# EAGLE design wohnzimmer_im_router (EAGLE 5.11)
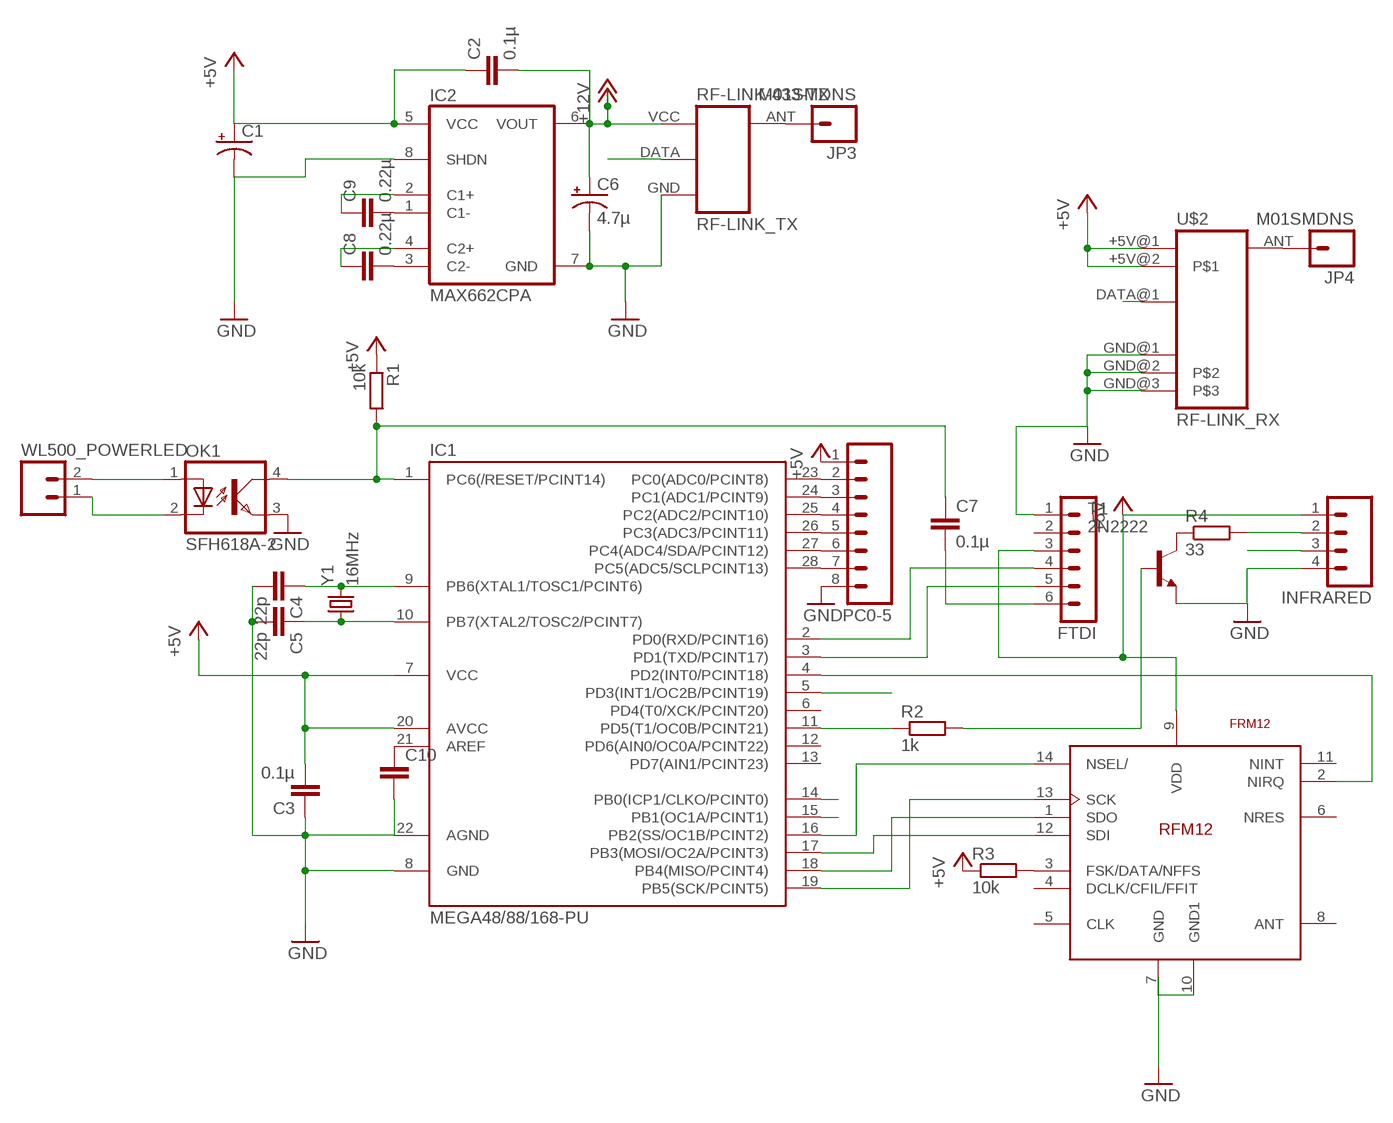
[diagram p0: schematic, sheet 1]

## Parts
C1  CAP_POLPTH2  [CPOL-RADIAL-10UF-25V]
C2  0.1µ  CAPKIT  [CAP-PTH-SMALL-KIT]
C3  0.1µ  CAPPTH  [CAP-PTH-SMALL]
C4  22p  CAPPTH  [CAP-PTH-SMALL]
C5  22p  CAPPTH  [CAP-PTH-SMALL]
C6  4.7µ  CAP_POLPTH2  [CPOL-RADIAL-10UF-25V]
C7  0.1µ  CAPKIT  [CAP-PTH-SMALL-KIT]
C8  0.22µ  CAPKIT  [CAP-PTH-SMALL-KIT]
C9  0.22µ  CAPKIT  [CAP-PTH-SMALL-KIT]
C10  CAPPTH  [CAP-PTH-SMALL]
FTDI  MA06-1  [MA06-1]
IC1  MEGA48/88/168-PU  [DIL28-3]
IC2  MAX662CPA  [DIL08]
INFRARED  M04PTH  [1X04]
JP3  M01SMDNS  [1X01NS]
JP4  M01SMDNS  [1X01NS]
OK1  SFH618A-2  [DIP4]
PC0-5  M08LOCK  [1X08_LOCK]
R1  10k  R-EU_0207/7  [0207/7]
R2  1k  R-EU_0204/7  [0204/7]
R3  10k  R-EU_0204/7  [0204/7]
R4  33  R-EU_0204/7  [0204/7]
RF-LINK-433-TX  RF-LINK_TX  [RF-LINK_TX]
T1  2N2222  [TO18]
U$1  FRM12  [RFM12]
U$2  RF-LINK_RX  [RF-LINK_RX]
WL500_POWERLED  M02LOCK  [1X02_LOCK]
Y1  16MHz  CRYSTALHC49US  [HC49US]

## Nets
+5V: C1.1(+) C2.1 C3.2 FTDI.3 IC1.7(VCC) IC1.20(AVCC) IC2.5(VCC) INFRARED.1 PC0-5.1 R1.1 R3.1 U$1.9(VDD) U$2.+5V@1(+5V) U$2.+5V@2
+12V: C2.2 C6.1(+) IC2.6(VOUT) RF-LINK-433-TX.VCC(+5V)
FOO: IC1.11(PD5(T1/OC0B/PCINT21)) R2.1
GND: C1.2(-) C3.1 C4.2 C5.2 C6.2(-) C10.2 FTDI.1 IC1.8(GND) IC1.22(AGND) IC2.7(GND) IC2.8(SHDN) INFRARED.4 OK1.3(EMIT) PC0-5.8 RF-LINK-433-TX.GND T1.1(E) U$1.7(GND) U$1.10(GND1) U$2.GND@1(GND) U$2.GND@2 U$2.GND@3
IR_DIODE-: INFRARED.2 R4.2
IR_RX: IC1.14(PB0(ICP1/CLKO/PCINT0)) INFRARED.3
MOSI: IC1.17(PB3(MOSI/OC2A/PCINT3)) U$1.12(SDI)
N$1: IC1.19(PB5(SCK/PCINT5)) U$1.13(SCK)
N$2: IC1.18(PB4(MISO/PCINT4)) U$1.1(SDO)
N$3: OK1.1(A) WL500_POWERLED.2
N$4: IC1.16(PB2(SS/OC1B/PCINT2)) U$1.14(NSEL/)
N$5: IC1.4(PD2(INT0/PCINT18)) U$1.2(NIRQ)
N$6: C5.1 IC1.10(PB7(XTAL2/TOSC2/PCINT7)) Y1.1
N$7: C4.1 IC1.9(PB6(XTAL1/TOSC1/PCINT6)) Y1.2
N$8: R2.2 T1.2(B)
N$9: C8.2 IC2.3(C2-)
N$10: C9.2 IC2.1(C1-)
N$13: C7.2 FTDI.6
N$14: C8.1 IC2.4(C2+)
N$15: R3.2 U$1.3(FSK/DATA/NFFS)
N$16: C9.1 IC2.2(C1+)
N$19: JP3.1 RF-LINK-433-TX.ANT
N$20: JP4.1 U$2.ANT
N$21: IC1.23(PC0(ADC0/PCINT8)) PC0-5.2
N$22: OK1.2(C) WL500_POWERLED.1
N$23: C10.1 IC1.21(AREF)
N$24: R4.1 T1.3(C)
N$25: IC1.24(PC1(ADC1/PCINT9)) PC0-5.3
N$26: IC1.25(PC2(ADC2/PCINT10)) PC0-5.4
N$27: IC1.26(PC3(ADC3/PCINT11)) PC0-5.5
N$28: IC1.27(PC4(ADC4/SDA/PCINT12)) PC0-5.6
N$29: IC1.28(PC5(ADC5/SCLPCINT13)) PC0-5.7
RESET: C7.1 IC1.1(PC6(/RESET/PCINT14)) OK1.4(COL) R1.2
RF_RX: IC1.5(PD3(INT1/OC2B/PCINT19)) U$2.DATA@1(DATA)
RF_TX: IC1.15(PB1(OC1A/PCINT1)) RF-LINK-433-TX.DATA
RX: FTDI.4 IC1.2(PD0(RXD/PCINT16))
TX: FTDI.5 IC1.3(PD1(TXD/PCINT17))
Unconnected: FTDI.2 IC1.6(PD4(T0/XCK/PCINT20)) IC1.12(PD6(AIN0/OC0A/PCINT22)) IC1.13(PD7(AIN1/PCINT23)) U$1.4(DCLK/CFIL/FFIT) U$1.5(CLK) U$1.6(NRES) U$1.8(ANT) U$1.11(NINT)

## Library data of the parts
C1 C6 = SparkFun:CAP_POL: Capacitor Polarized These are standard SMD and PTH capacitors. Normally 10uF, 47uF, and 100uF in electrolytic and tantalum varieties. Always verify the external diameter of the through hole cap, it varies with capacity, voltage, and manufacturer. The EIA devices should be standard.
C2-C5 C7-C10 = SparkFun:CAP: Capacitor Standard 0603 ceramic capacitor, and 0.1" leaded capacitor.
FTDI = con-lstb:MA06-1: PIN HEADER; OC_FARNELL: unknown; OC_NEWARK: unknown
IC1 = avr-7:MEGA48/88/168-PU
IC2 = maxim:MAX662CPA: SUPPLY CHARGE PUMP; OC_FARNELL: unknown; OC_NEWARK: unknown
INFRARED = SparkFun:M04: Header 4 Standard 4-pin 0.1" header. Use with straight break away headers (SKU : PRT-00116), right angle break away headers (PRT-00553), swiss pins (PRT-00743), machine pins (PRT-00117), and female headers (PRT-00115). Molex polarized connector foot print use with SKU : PRT-08231 with associated crimp pins and housings. 1MM SMD Version SKU: PRT-10208
JP3 JP4 = SparkFun:M01: Header 1 Standard 1-pin 0.1" header. Use with straight break away headers (SKU : PRT-00116), right angle break away headers (PRT-00553), swiss pins (PRT-00743), machine pins (PRT-00117), and female headers (PRT-00115).
OK1 = optocoupler:SFH618?*: Optocoupler, Phototransistor Output, Low Input Current Source: http://www.vishay.com/docs/83673/sfh618.pdf; MF: VISHAY/TELEFUNKEN; MPN: SFH618A-2; OC_FARNELL: 6424855; OC_NEWARK: 21H7744
PC0-5 = SparkFun:M08: Header 8 Standard 8-pin 0.1" header. Use with straight break away headers (SKU : PRT-00116), right angle break away headers (PRT-00553), swiss pins (PRT-00743), machine pins (PRT-00117), and female headers (PRT-00115).
R1-R4 = rcl:R-EU_: RESISTOR, European symbol
RF-LINK-433-TX = SparkFun:RF-LINK_TX
T1 = transistor:2N2222: NPN TRANSISTOR
U$1 = RFM12:FRM12
U$2 = SparkFun:RF-LINK_RX
WL500_POWERLED = SparkFun:M02: Header 2 Standard 2-pin 0.1" header. Use with straight break away headers (SKU : PRT-00116), right angle break away headers (PRT-00553), swiss pins (PRT-00743), machine pins (PRT-00117), and female headers (PRT-00115). Molex polarized connector foot print use with SKU : PRT-08233 with associated crimp pins and housings.
Y1 = SparkFun:CRYSTAL: Crystals Various standard crystals. Proven footprints. Spark Fun Electronics SKU : COM-00534

## Board
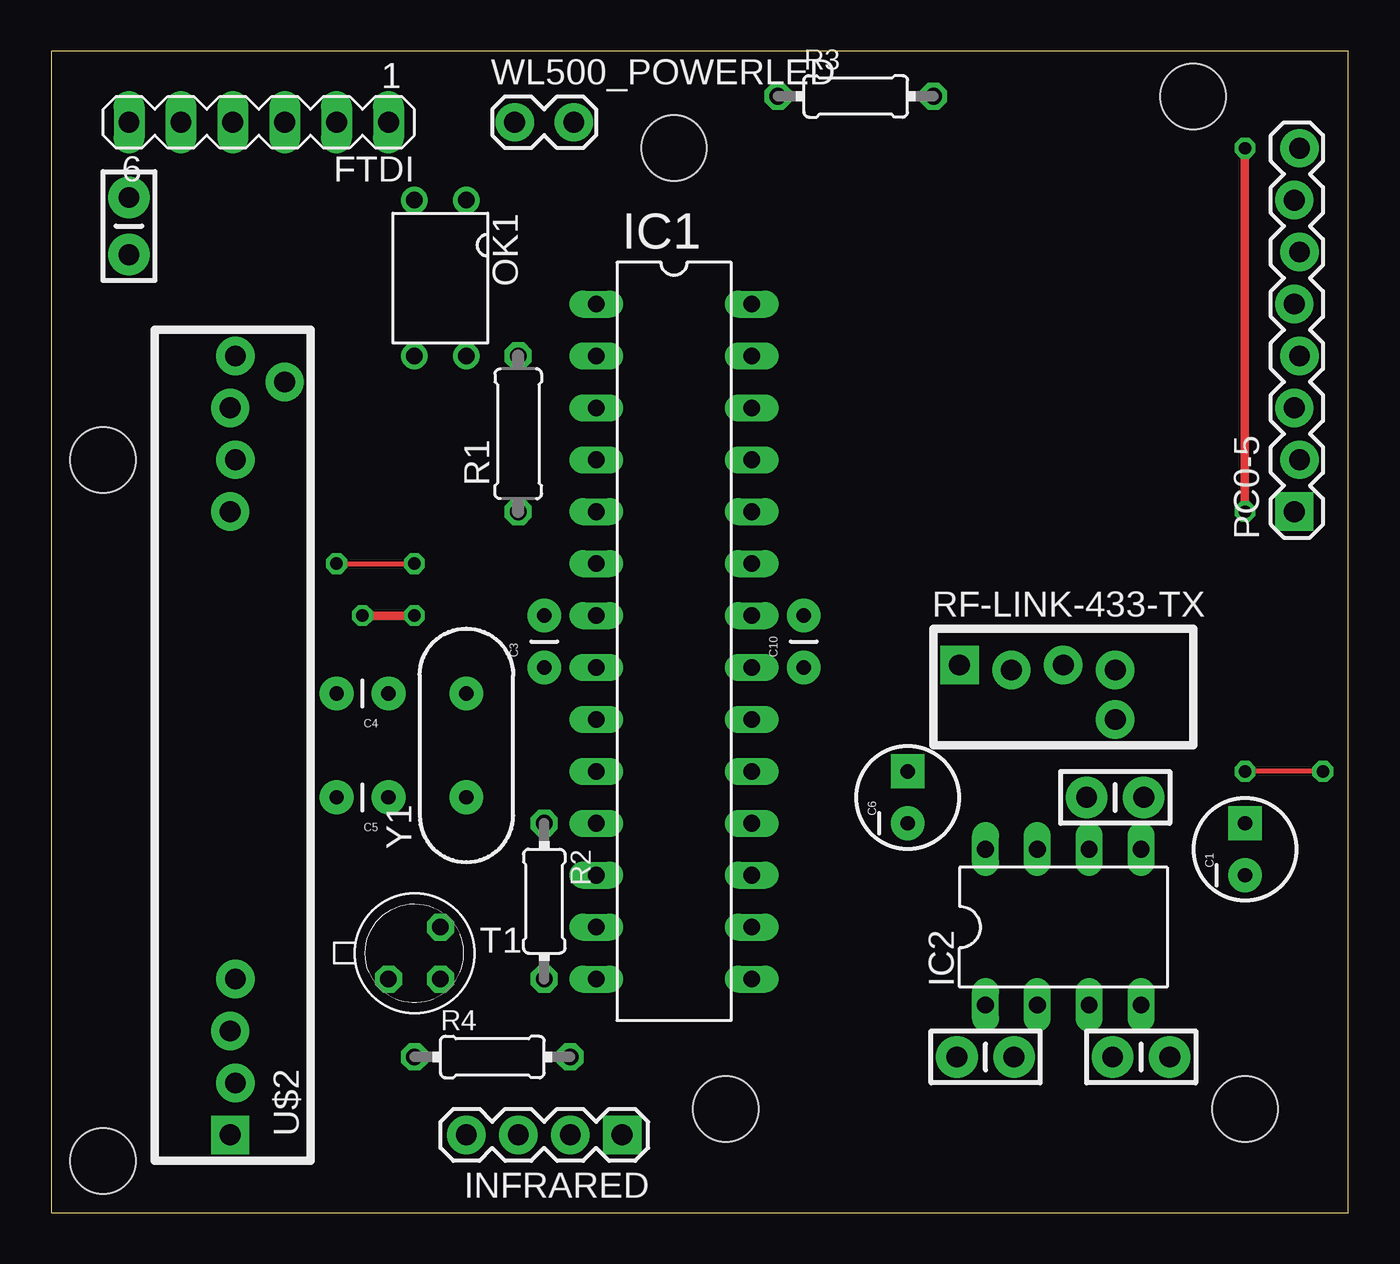
[diagram p1: board, top side]
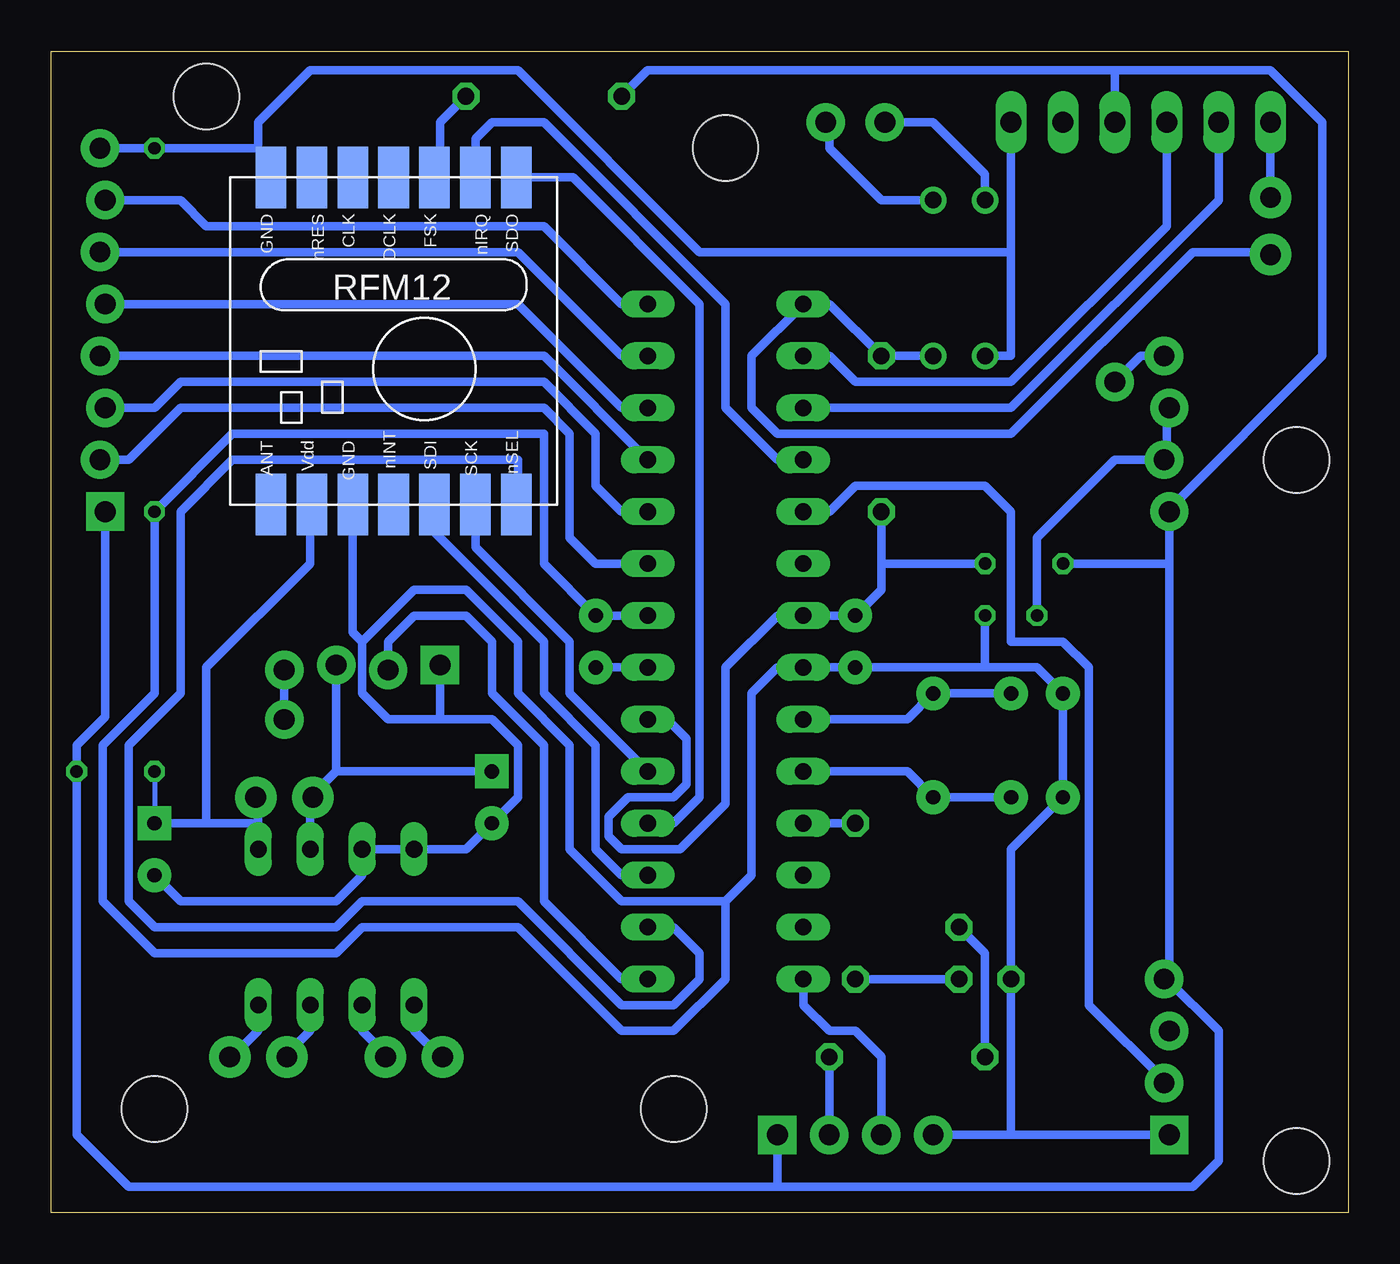
[diagram p2: board, bottom side, seen from below]

Size 63.48 x 56.82 mm. Coordinates in mm from the lower left corner, seen from the top.
Outline: 0,0 63.48,0 63.48,56.82 0,56.82 0,0
Copper layers (1*16): Top 0.035mm / dielectric 1.5mm / Bottom 0.035mm
Design rules "default": minimum track width 10mil, minimum drill 24mil, track to track 8mil, track to pad 8mil, pad to pad 8mil, via to via 8mil, smd to smd 8mil, copper to edge 40mil, drill to drill 8mil, minimum pad ring 10mil, minimum via ring 8mil, stop-mask expansion 4mil, vias tented up to drill 0mil, thermal gap 10mil
Holes 3.2 mm at 2.54,2.54 30.48,52.07 55.88,54.61 58.42,5.08 2.54,36.83 33.02,5.08

### Footprints (pad centres in the part's own frame; a part is rotated, then mirrored left to right if it is on the bottom)
CPOL-RADIAL-10UF-25V = drill 0.7 pad 1.651 square: 1 1.27,0 | drill 0.7 pad 1.651 round: 2 -1.27,0
CAP-PTH-SMALL-KIT = drill 1.016 pad 2.032 round: 1 -1.397,0; 2 1.397,0
CAP-PTH-SMALL = drill 0.7 pad 1.651 round: 1 0,0; 2 2.54,0
MA06-1 = drill 1.016 long: 1 -6.35,0; 2 -3.81,0; 3 -1.27,0; 4 1.27,0; 5 3.81,0; 6 6.35,0
DIL28-3 = drill 0.813 long: 1 -16.51,-3.81; 2 -13.97,-3.81; 3 -11.43,-3.81; 4 -8.89,-3.81; 5 -6.35,-3.81; 6 -3.81,-3.81; 7 -1.27,-3.81; 8 1.27,-3.81; 9 3.81,-3.81; 10 6.35,-3.81; 11 8.89,-3.81; 12 11.43,-3.81; 13 13.97,-3.81; 14 16.51,-3.81; 15 16.51,3.81; 16 13.97,3.81; 17 11.43,3.81; 18 8.89,3.81; 19 6.35,3.81; 20 3.81,3.81; 21 1.27,3.81; 22 -1.27,3.81; 23 -3.81,3.81; 24 -6.35,3.81; 25 -8.89,3.81; 26 -11.43,3.81; 27 -13.97,3.81; 28 -16.51,3.81
DIL08 = drill 0.813 long: 1 -3.81,-3.81; 2 -1.27,-3.81; 3 1.27,-3.81; 4 3.81,-3.81; 5 3.81,3.81; 6 1.27,3.81; 7 -1.27,3.81; 8 -3.81,3.81
1X04 = drill 1.016 pad 1.88 square: 1 0,0 | drill 1.016 pad 1.88 round: 2 2.54,0; 3 5.08,0; 4 7.62,0
1X01NS = drill 1.016 pad 1.88 round: 1 0,0
DIP4 = drill 0.8 round: 1 -1.27,-3.81; 2 1.27,-3.81; 3 1.27,3.81; 4 -1.27,3.81
1X08_LOCK = drill 1.016 pad 1.88 square: 1 0,0.127 | drill 1.016 pad 1.88 round: 2 2.54,-0.127; 3 5.08,0.127; 4 7.62,-0.127; 5 10.16,0.127; 6 12.7,-0.127; 7 15.24,0.127; 8 17.78,-0.127
0207/7 = drill 0.813 octagon: 1 -3.81,0; 2 3.81,0
0204/7 = drill 0.813 octagon: 1 -3.81,0; 2 3.81,0
RF-LINK_TX = drill 1.016 pad 1.88 round: ANT 7.62,-0.127; DATA 2.54,-0.127; VCC 5.08,0.127 | drill 1.016 pad 1.88 square: GND 0,0.127
TO18 = drill 0.813 octagon: 1 -1.27,-1.27; 2 1.27,-1.27; 3 1.27,1.27
RFM12 = smd 1.5 x 3: 1 -5,-10; 2 -3,-10; 3 -1,-10; 4 1,-10; 5 3,-10; 6 5,-10; 7 7,-10; 8 7,6; 9 5,6; 10 3,6; 11 1,6; 12 -1,6; 13 -3,6; 14 -5,6
RF-LINK_RX = drill 1.016 pad 1.88 round: +5V@1 7.62,-0.127; +5V@2 30.48,0.127; ANT 38.1,-0.127; DATA@1 2.54,-0.127; DATA@2 5.08,0.127; GND@2 33.02,-0.127; GND@3 35.56,0.127 | drill 1.016 pad 1.88 square: GND@1 0,0.127
1X02_LOCK = drill 1.016 pad 1.88 round: 1 -0.178,0; 2 2.718,0
HC49US = drill 0.7 pad 1.651 round: 1 -2.54,0; 2 2.54,0

### Placement (x,y rotation side)
C1  58.42,17.78 90 top
C2  52.07,20.32 180 top
C3  24.13,26.67 90 top
C4  16.51,25.4 180 top
C5  16.51,20.32 180 top
C6  41.91,20.32 90 top
C7  3.81,48.26 90 top
C8  53.34,7.62 180 top
C9  45.72,7.62 180 top
C10  36.83,26.67 90 top
FTDI  10.16,53.34 180 top
IC1  30.48,27.94 270 top
IC2  49.53,13.97 0 top
INFRARED  27.94,3.81 180 top
JP3  52.07,24.13 90 top
JP4  11.43,40.64 0 top
OK1  19.05,45.72 180 top
PC0-5  60.96,34.29 90 top
R1  22.86,38.1 90 top
R2  24.13,15.24 270 top
R3  39.37,54.61 0 top
R4  21.59,7.62 0 top
RF-LINK-433-TX  44.45,26.67 0 top
T1  17.78,12.7 0 top
U$1  45.72,40.64 180 bottom
U$2  8.89,3.81 90 top
WL500_POWERLED  22.86,53.34 0 top
Y1  20.32,22.86 90 top

### Tracks (layer width: path | path; a pad name or v marks a point on that pad's centre or on a via)
+5V  (via drill 0.61)
  Top 0.254: v62.23,21.59 v58.42,21.59 | v13.97,31.75 v17.78,31.75
  Bottom 0.254: 22.86,30.48 22.86,31.75 R1.1 | 53.34,20.32 C2.1 | 3.81,55.88 8.89,55.88 | U$2.+5V@2 8.89,34.29 | v58.42,21.59 C1.1 | v62.23,21.59 62.23,15.24
  Bottom 0.406: 53.34,19.05 IC2.5 | 53.34,19.05 53.34,20.32 | 55.88,19.05 53.34,19.05 | C1.1 55.88,19.05 | 8.76,31.75 8.76,11.68 U$2.+5V@1 8.89,11.43 6.35,8.89 6.35,2.54 7.62,1.27 27.94,1.27 | 8.76,31.75 U$2.+5V@2 | 55.88,19.05 55.88,26.67 50.8,31.75 50.8,34.29 U$1.9 | PC0-5.1 60.83,24.26 62.23,22.86 v62.23,21.59 62.23,3.81 59.69,1.27 27.94,1.27 | 27.94,1.27 INFRARED.1 | 8.76,31.75 v13.97,31.75 | v17.78,31.75 22.86,31.75 | R1.1 22.86,30.48 C3.2 IC1.7 27.94,29.21 30.48,26.67 30.48,20 32.7,17.78 35.56,17.78 36.2,18.41 36.2,19.37 35.24,20.32 33.02,20.32 32.38,20.95 32.38,23.18 33.34,24.13 IC1.20 | 11.43,54.61 FTDI.3 11.43,55.88 | 8.89,34.29 1.27,41.91 1.27,53.34 3.81,55.88 11.43,55.88 | R3.1 34.29,55.88 11.43,55.88
+12V
  Bottom 0.254: 49.53,26.67 RF-LINK-433-TX.VCC | 50.8,20.32 C2.2
  Bottom 0.406: IC2.6 50.8,20.32 49.53,21.59 | 49.53,21.59 49.53,26.67 | C6.1 49.53,21.59
FOO
  Bottom 0.406: R2.1 IC1.11
GND  (via drill 0.6, 0.61)
  Top 0.406: v17.78,29.21 v15.24,29.21 | v58.42,34.29 v58.42,52.07
  Bottom 0.254: 44.45,26.67 RF-LINK-433-TX.GND | 53.34,49.53 U$1.7 53.34,50.8 53.34,52.07
  Bottom 0.406: C1.2 57.15,15.24 49.53,15.24 48.26,16.51 IC2.7 IC2.8 43.18,17.78 C6.2 40.64,20.32 40.64,22.86 41.91,24.13 44.45,24.13 | 17.78,26.67 15.24,26.67 C4.2 C5.2 16.51,17.78 T1.1 16.51,3.81 | 17.78,26.67 C3.1 IC1.8 27.94,26.67 29.21,25.4 29.21,16.51 30.48,15.24 | 19.05,3.81 INFRARED.4 16.51,3.81 | 16.51,46.99 16.51,41.91 OK1.3 | 16.51,46.99 FTDI.1 | U$2.GND@3 8.89,39.37 8.89,36.83 U$2.GND@2 11.43,36.83 15.24,33.02 v15.24,29.21 | 17.78,26.67 v17.78,29.21 | PC0-5.8 v58.42,52.07 53.34,52.07 53.34,53.34 50.8,55.88 40.64,55.88 31.75,46.99 16.51,46.99 | 30.48,15.24 35.56,15.24 38.1,17.78 38.1,22.86 40.64,25.4 40.64,27.94 43.18,30.48 45.72,30.48 48.26,27.94 | 30.48,15.24 30.48,11.43 33.02,8.89 35.56,8.89 40.64,13.97 48.26,13.97 49.53,12.7 58.42,12.7 60.96,15.24 60.96,22.86 58.42,25.4 v58.42,34.29 54.61,38.1 39.37,38.1 39.37,31.75 C10.2 IC1.22 | 48.26,27.94 48.26,25.4 46.99,24.13 44.45,24.13 | 44.45,24.13 44.45,26.67 | U$2.GND@1 16.51,3.81 | U$1.10 48.72,28.4 48.26,27.94
IR_DIODE-
  Bottom 0.406: INFRARED.2 R4.2
IR_RX
  Bottom 0.406: IC1.14 26.67,10.16 25.4,8.89 24.13,8.89 22.86,7.62 INFRARED.3
MOSI
  Bottom 0.406: U$1.12 44.72,33.29 39.37,27.94 39.37,25.4 36.83,22.86 36.83,17.78 35.56,16.51 IC1.17
N$1
  Bottom 0.406: U$1.13 42.72,32.56 38.1,27.94 38.1,25.4 IC1.19
N$2
  Bottom 0.406: U$1.1 37.94,50.64 31.75,44.45 31.75,20.32 33.02,19.05 IC1.18
N$3
  Bottom 0.406: OK1.1 22.86,49.53 25.4,52.07 25.4,53.16 WL500_POWERLED.2
N$4
  Bottom 0.406: U$1.14 40.64,35.56 40.64,36.83 54.61,36.83 57.15,34.29 57.15,25.4 59.69,22.86 59.69,15.24 58.42,13.97 49.53,13.97 48.26,15.24 40.64,15.24 35.56,10.16 33.02,10.16 31.75,11.43 31.75,12.7 33.02,13.97 IC1.16
N$5
  Bottom 0.406: U$1.2 42.72,52.53 41.91,53.34 39.37,53.34 30.48,44.45 30.48,39.37 27.94,36.83 IC1.4
N$6
  Bottom 0.406: IC1.10 21.59,21.59 Y1.1 C5.1
N$7
  Bottom 0.406: IC1.9 21.59,24.13 Y1.2 C4.1
N$8
  Bottom 0.406: T1.2 R2.2
N$9
  Bottom 0.254: C8.2 52.07,7.62
  Bottom 0.406: IC2.3 50.8,8.89 52.07,7.62
N$10
  Bottom 0.254: C9.2 44.45,7.62
  Bottom 0.406: 44.45,7.62 45.72,8.89 IC2.1
N$13
  Bottom 0.406: 3.81,49.53 C7.2 FTDI.6
N$14
  Bottom 0.254: C8.1 54.61,7.62
  Bottom 0.406: IC2.4 53.34,8.89 54.61,7.62
N$15
  Bottom 0.406: R3.2 44.45,53.34 44.45,50.91 U$1.3
N$16
  Bottom 0.254: C9.1 46.99,7.62
  Bottom 0.406: 46.99,7.62 48.26,8.89 IC2.2
N$19
  Bottom 0.406: JP3.1 RF-LINK-433-TX.ANT
N$20
  Bottom 0.406: U$2.ANT 10.16,41.91 JP4.1
N$21
  Bottom 0.406: PC0-5.2 59.69,36.83 57.15,39.37 39.37,39.37 38.1,38.1 38.1,33.02 36.83,31.75 IC1.23
N$22
  Bottom 0.406: OK1.2 17.78,50.8 20.32,53.34 WL500_POWERLED.1
N$23
  Bottom 0.406: IC1.21 C10.1
N$24
  Bottom 0.406: T1.3 17.78,12.7 R4.1
N$25
  Bottom 0.406: PC0-5.3 58.42,39.37 57.15,40.64 39.37,40.64 36.83,38.1 36.83,35.56 35.56,34.29 IC1.24
N$26
  Bottom 0.406: PC0-5.4 39.37,41.91 IC1.25
N$27
  Bottom 0.406: PC0-5.5 40.64,44.45 35.56,39.37 IC1.26
N$28
  Bottom 0.406: PC0-5.6 40.64,46.99 35.56,41.91 IC1.27
N$29
  Bottom 0.406: IC1.28 35.56,44.45 39.37,48.26 55.88,48.26 57.15,49.53 PC0-5.7
RESET
  Bottom 0.406: OK1.4 R1.2 25.4,44.45 IC1.1 29.21,41.91 29.21,39.37 27.94,38.1 16.51,38.1 7.62,46.99 3.81,46.99 C7.1
RF_RX
  Bottom 0.406: U$2.DATA@1 8.89,6.35 12.7,10.16 12.7,26.67 13.97,27.94 16.51,27.94 16.51,34.29 17.78,35.56 24.13,35.56 25.4,34.29 IC1.5
RF_TX
  Bottom 0.406: RF-LINK-433-TX.DATA 46.99,27.94 45.72,29.21 43.18,29.21 41.91,27.94 41.91,25.4 39.37,22.86 39.37,15.24 35.56,11.43 IC1.15
RX
  Bottom 0.406: IC1.2 25.4,41.91 24.13,40.64 16.51,40.64 8.89,48.26 FTDI.4
TX
  Bottom 0.406: IC1.3 16.51,39.37 6.35,49.53 FTDI.5